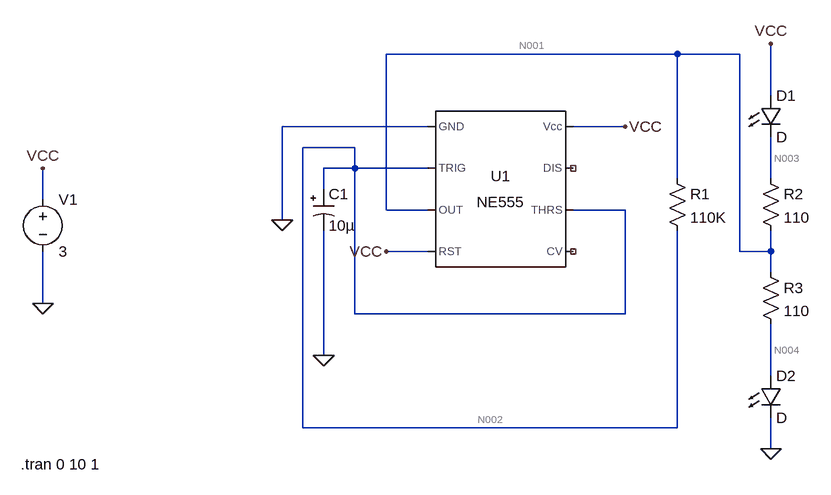
[diagram p0: schematic getting-to-blinky.asc]
getting-to-blinky.asc, the LTspice schematic file:
Version 4
SHEET 1 880 680
WIRE 480 -32 32 -32
WIRE 576 -32 480 -32
WIRE 624 32 624 -48
WIRE 96 80 -128 80
WIRE 400 80 320 80
WIRE -16 112 -96 112
WIRE -16 144 -16 112
WIRE -16 144 -64 144
WIRE 96 144 -16 144
WIRE 480 160 480 -32
WIRE 624 160 624 96
WIRE -64 176 -64 144
WIRE -496 192 -496 144
WIRE 32 208 32 -32
WIRE 96 208 32 208
WIRE 400 208 320 208
WIRE -128 224 -128 80
WIRE 96 272 32 272
WIRE 576 272 576 -32
WIRE 624 272 624 240
WIRE 624 272 576 272
WIRE 624 304 624 272
WIRE -496 352 -496 272
WIRE -16 368 -16 144
WIRE 400 368 400 208
WIRE 400 368 -16 368
WIRE -64 432 -64 240
WIRE 624 464 624 384
WIRE -96 544 -96 112
WIRE 480 544 480 240
WIRE 480 544 -96 544
WIRE 624 576 624 528
FLAG -128 224 0
FLAG -64 432 0
FLAG 624 576 0
FLAG -496 352 0
FLAG -496 144 VCC
FLAG 400 80 VCC
FLAG 624 -48 VCC
FLAG 32 272 VCC
SYMBOL Misc\\NE555 208 176 R0
SYMATTR InstName U1
SYMBOL polcap -80 176 R0
WINDOW 3 24 56 Left 2
SYMATTR InstName C1
SYMATTR Value 10µ
SYMATTR Description Capacitor
SYMATTR Type cap
SYMATTR SpiceLine V=6.3 Irms=0 Rser=4 Lser=0
SYMBOL res 464 144 R0
SYMATTR InstName R1
SYMATTR Value 110K
SYMBOL res 608 144 R0
SYMATTR InstName R2
SYMATTR Value 110
SYMBOL res 608 288 R0
SYMATTR InstName R3
SYMATTR Value 110
SYMBOL LED 608 32 R0
SYMATTR InstName D1
SYMBOL LED 608 464 R0
SYMATTR InstName D2
SYMBOL voltage -496 176 R0
WINDOW 123 0 0 Left 2
WINDOW 39 0 0 Left 2
SYMATTR InstName V1
SYMATTR Value 3
TEXT -530 600 Left 2 !.tran 0 10 1

The netlist it stands for:
* getting-to-blinky.asc
XU1 0 N002 N001 VCC NC_01 N002 NC_02 VCC NE555  ; pins GND TRIG OUT RST CV THRS DIS Vcc
C1 N002 0 10µ V=6.3 Irms=0 Rser=4 Lser=0
R1 N001 N002 110K
R2 N003 N001 110
R3 N001 N004 110
D1 VCC N003 D
D2 N004 0 D
V1 VCC 0 3
.model D D
.lib standard.dio
.tran 0 10 1
.lib NE555.sub
.backanno
.end

* Results of the author's LTspice run, read from the files saved beside the schematic
* Operating Point, zero values left out:
*   V(n002) = 2.882 V
*   V(vcc) = 3 V
*   V(n001) = 2.883 V
*   V(n003) = 2.883 V
*   V(n004) = 732 mV
*   I(D2) = 19.55 mA
*   I(D1) = 1.041 pA
*   I(R3) = 19.55 mA
*   I(R2) = 1.04 pA
*   I(R1) = 5.764 nA
*   I(V1) = -20.51 mA
*   Ix(u1:1) = -962.2 µA
*   Ix(u1:2) = 2.882 nA
*   Ix(u1:3) = -19.55 mA
*   Ix(u1:4) = 9.333 µA
*   Ix(u1:6) = 2.882 nA
*   Ix(u1:8) = 20.5 mA
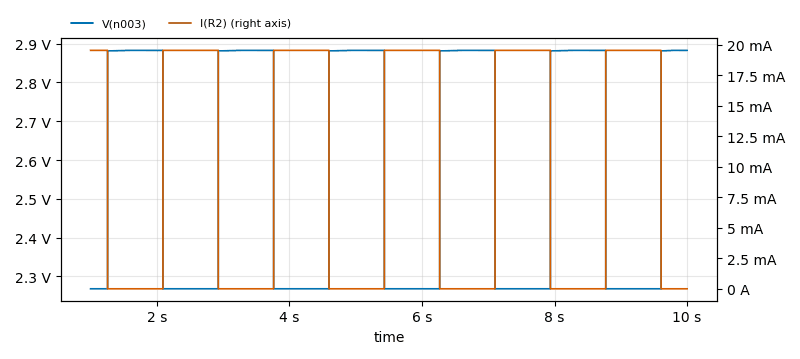
[diagram p1: Transient Analysis of getting-to-blinky.asc, plotted from the saved traces]
* Transient Analysis, 1 run:
*   V(n003): min 2.268 V, max 2.883 V, average 2.58 V, rms 2.598 V, last 2.883 V
*   I(R2): min 0 A, max 19.55 mA, average 9.626 mA, rms 13.72 mA, last 0 A